# Altium project SysP17_Team10.PrjPcb
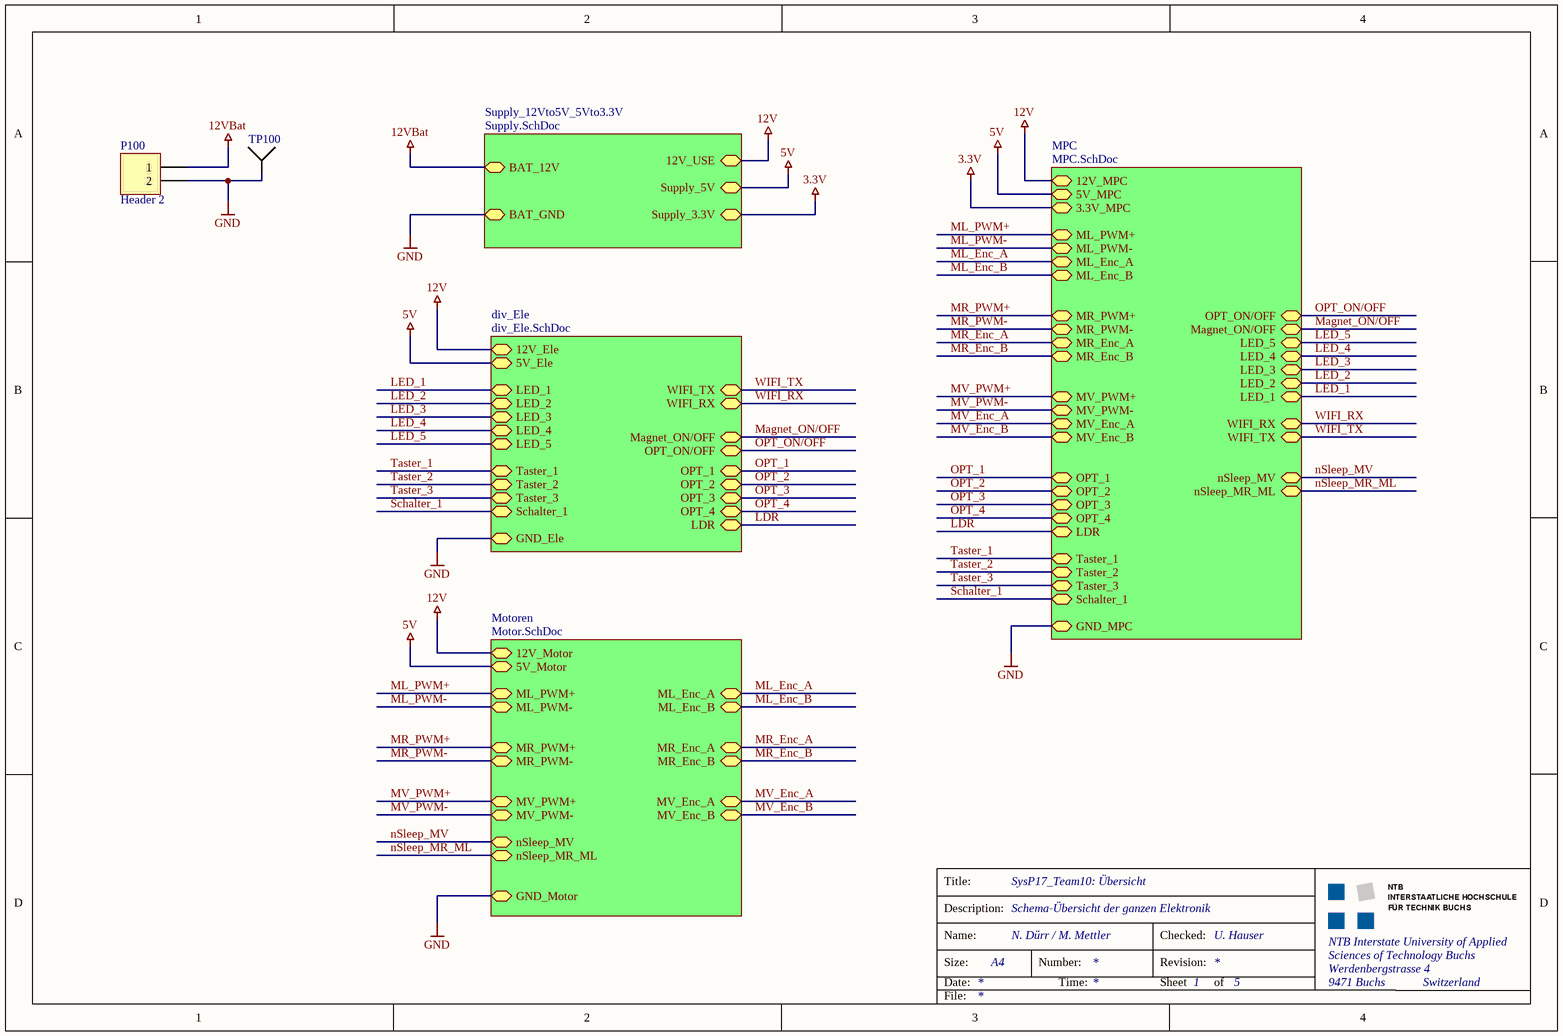
[diagram p0: SysP_Uebersicht.SchDoc]
4 sheets, 92 parts. Net scope: hierarchical (ports join the sheet entries above them; power ports are global).
Board file: Print.PcbDoc
Sheets:
  SysP_Uebersicht.SchDoc
    Supply_12Vto5V_5Vto3.3V = Supply.SchDoc
    div_Ele = div_Ele.SchDoc
    MPC = MPC.SchDoc

## Sheet SysP_Uebersicht.SchDoc: SysP17_Team10: Übersicht
size A4; CheckedBy: U. Hauser; Author: N. Dürr / M. Mettler; CompanyName: NTB; Organization: NTB Interstate University of Applied; Address1: Werdenbergstrasse 4; Address3: 9471 Buchs; Address4: Switzerland; SheetNumber: 1; SheetTotal: 5; Organization1: Sciences of Technology Buchs; Size: A4; ShortDescription: Schema-Übersicht der ganzen Elektronik

### Parts
P100  Header 2  [Connector_Bat_2]
TP100  Testpunkt 1mm  [GEN_TP-THT-1.1mm_1_H]  (value not drawn)

### Sub-sheets
div_Ele = div_Ele.SchDoc: LED_1, LED_2, LED_3, LED_4, LED_5, Taster_1, Taster_2, Taster_3, Schalter_1, WIFI_TX, WIFI_RX, Magnet_ON/OFF, OPT_ON/OFF, OPT_1, OPT_2, OPT_3, OPT_4, LDR, GND_Ele, 12V_Ele, 5V_Ele
Motoren = Motor.SchDoc (file not in this document): ML_PWM+, ML_PWM-, ML_Enc_A, ML_Enc_B, MR_PWM+, MR_PWM-, MR_Enc_A, MR_Enc_B, MV_PWM+, MV_PWM-, MV_Enc_A, MV_Enc_B, 12V_Motor, 5V_Motor, GND_Motor, nSleep_MV, nSleep_MR_ML
MPC = MPC.SchDoc: ML_PWM+, ML_PWM-, ML_Enc_A, ML_Enc_B, MR_PWM+, MR_PWM-, MR_Enc_A, MR_Enc_B, MV_PWM+, MV_PWM-, MV_Enc_A, MV_Enc_B, OPT_1, OPT_2, OPT_3, OPT_4, OPT_ON/OFF, Taster_1, Taster_2, Taster_3, Schalter_1, Magnet_ON/OFF, LED_5, LED_4, LED_3, LED_2, LED_1, WIFI_TX, WIFI_RX, LDR, 12V_MPC, 5V_MPC, 3.3V_MPC, GND_MPC, nSleep_MV, nSleep_MR_ML
Supply_12Vto5V_5Vto3.3V = Supply.SchDoc: BAT_12V, BAT_GND, Supply_5V, Supply_3.3V, 12V_USE

### Nets
3.3V: sheet Supply_12Vto5V_5Vto3.3V/Supply_3.3V, sheet MPC/3.3V_MPC
5V: sheet Supply_12Vto5V_5Vto3.3V/Supply_5V, sheet div_Ele/5V_Ele, sheet Motoren/5V_Motor, sheet MPC/5V_MPC
12V: sheet Supply_12Vto5V_5Vto3.3V/12V_USE, sheet div_Ele/12V_Ele, sheet Motoren/12V_Motor, sheet MPC/12V_MPC
12VBat: P100.1 ; sheet Supply_12Vto5V_5Vto3.3V/BAT_12V
GND: P100.2 TP100.1 ; sheet Supply_12Vto5V_5Vto3.3V/BAT_GND, sheet div_Ele/GND_Ele, sheet Motoren/GND_Motor, sheet MPC/GND_MPC
LDR: sheet div_Ele/LDR, sheet MPC/LDR
LED_1: sheet div_Ele/LED_1, sheet MPC/LED_1
LED_2: sheet div_Ele/LED_2, sheet MPC/LED_2
LED_3: sheet div_Ele/LED_3, sheet MPC/LED_3
LED_4: sheet div_Ele/LED_4, sheet MPC/LED_4
LED_5: sheet div_Ele/LED_5, sheet MPC/LED_5
Magnet_ON/OFF: sheet div_Ele/Magnet_ON/OFF, sheet MPC/Magnet_ON/OFF
ML_Enc_A: sheet Motoren/ML_Enc_A, sheet MPC/ML_Enc_A
ML_Enc_B: sheet Motoren/ML_Enc_B, sheet MPC/ML_Enc_B
ML_PWM+: sheet Motoren/ML_PWM+, sheet MPC/ML_PWM+
ML_PWM-: sheet Motoren/ML_PWM-, sheet MPC/ML_PWM-
MR_Enc_A: sheet Motoren/MR_Enc_A, sheet MPC/MR_Enc_A
MR_Enc_B: sheet Motoren/MR_Enc_B, sheet MPC/MR_Enc_B
MR_PWM+: sheet Motoren/MR_PWM+, sheet MPC/MR_PWM+
MR_PWM-: sheet Motoren/MR_PWM-, sheet MPC/MR_PWM-
MV_Enc_A: sheet Motoren/MV_Enc_A, sheet MPC/MV_Enc_A
MV_Enc_B: sheet Motoren/MV_Enc_B, sheet MPC/MV_Enc_B
MV_PWM+: sheet Motoren/MV_PWM+, sheet MPC/MV_PWM+
MV_PWM-: sheet Motoren/MV_PWM-, sheet MPC/MV_PWM-
nSleep_MR_ML: sheet Motoren/nSleep_MR_ML, sheet MPC/nSleep_MR_ML
nSleep_MV: sheet Motoren/nSleep_MV, sheet MPC/nSleep_MV
OPT_1: sheet div_Ele/OPT_1, sheet MPC/OPT_1
OPT_2: sheet div_Ele/OPT_2, sheet MPC/OPT_2
OPT_3: sheet div_Ele/OPT_3, sheet MPC/OPT_3
OPT_4: sheet div_Ele/OPT_4, sheet MPC/OPT_4
OPT_ON/OFF: sheet div_Ele/OPT_ON/OFF, sheet MPC/OPT_ON/OFF
Schalter_1: sheet div_Ele/Schalter_1, sheet MPC/Schalter_1  [project net Schalter1+]
Taster_1: sheet div_Ele/Taster_1, sheet MPC/Taster_1  [project net Taster1+]
Taster_2: sheet div_Ele/Taster_2, sheet MPC/Taster_2  [project net Taster2+]
Taster_3: sheet div_Ele/Taster_3, sheet MPC/Taster_3  [project net Taster3+]
WIFI_RX: sheet div_Ele/WIFI_RX, sheet MPC/WIFI_RX
WIFI_TX: sheet div_Ele/WIFI_TX, sheet MPC/WIFI_TX

### Notes on the sheet
- Title:
- Description:
- Size:
- Date:
- Name:
- Number:
- Time:
- Revision:
- Sheet
- Checked:
- of
- File:

### Library data of the parts
P100 = Header 2: Header, 2-Pin; LatestRevisionDate: 17-Jul-2002; LatestRevisionNote: Re-released for DXP Platform.; Publisher: Altium Limited
TP100 = Testpunkt 1mm: Manufacturer: Keystone Electronics; #Class: Connector; #ClassSub: Laborbuchse; Publisher: B.Sc. Ursella; Published: 2008-12-16; Supplier 1: Mouser; Supplier Part Number 1: 534-1035; Status: nLager; FootprintRef: GEN_TP-THT-1.1mm_1_H; RefFootprint: GEN_TP-THT-1.1mm_1_H; RefFileFOO: *; RefFileSCH: *; RefSchema: Testpunkt 1mm

## Sheet Supply.SchDoc: SysP_Team10: Spannungsregler
size A4; CheckedBy: U. Hauser; Author: N. Dürr / M. Mettler; CompanyName: NTB; Organization: NTB Interstate University of Applied; Address1: Werdenbergstrasse 4; Address3: 9471 Buchs; Address4: Switzerland; SheetNumber: 2; SheetTotal: 5; Organization1: Sciences of Technology Buchs; Size: A4; ShortDescription: Schema der Spannungsregelung-Schaltung
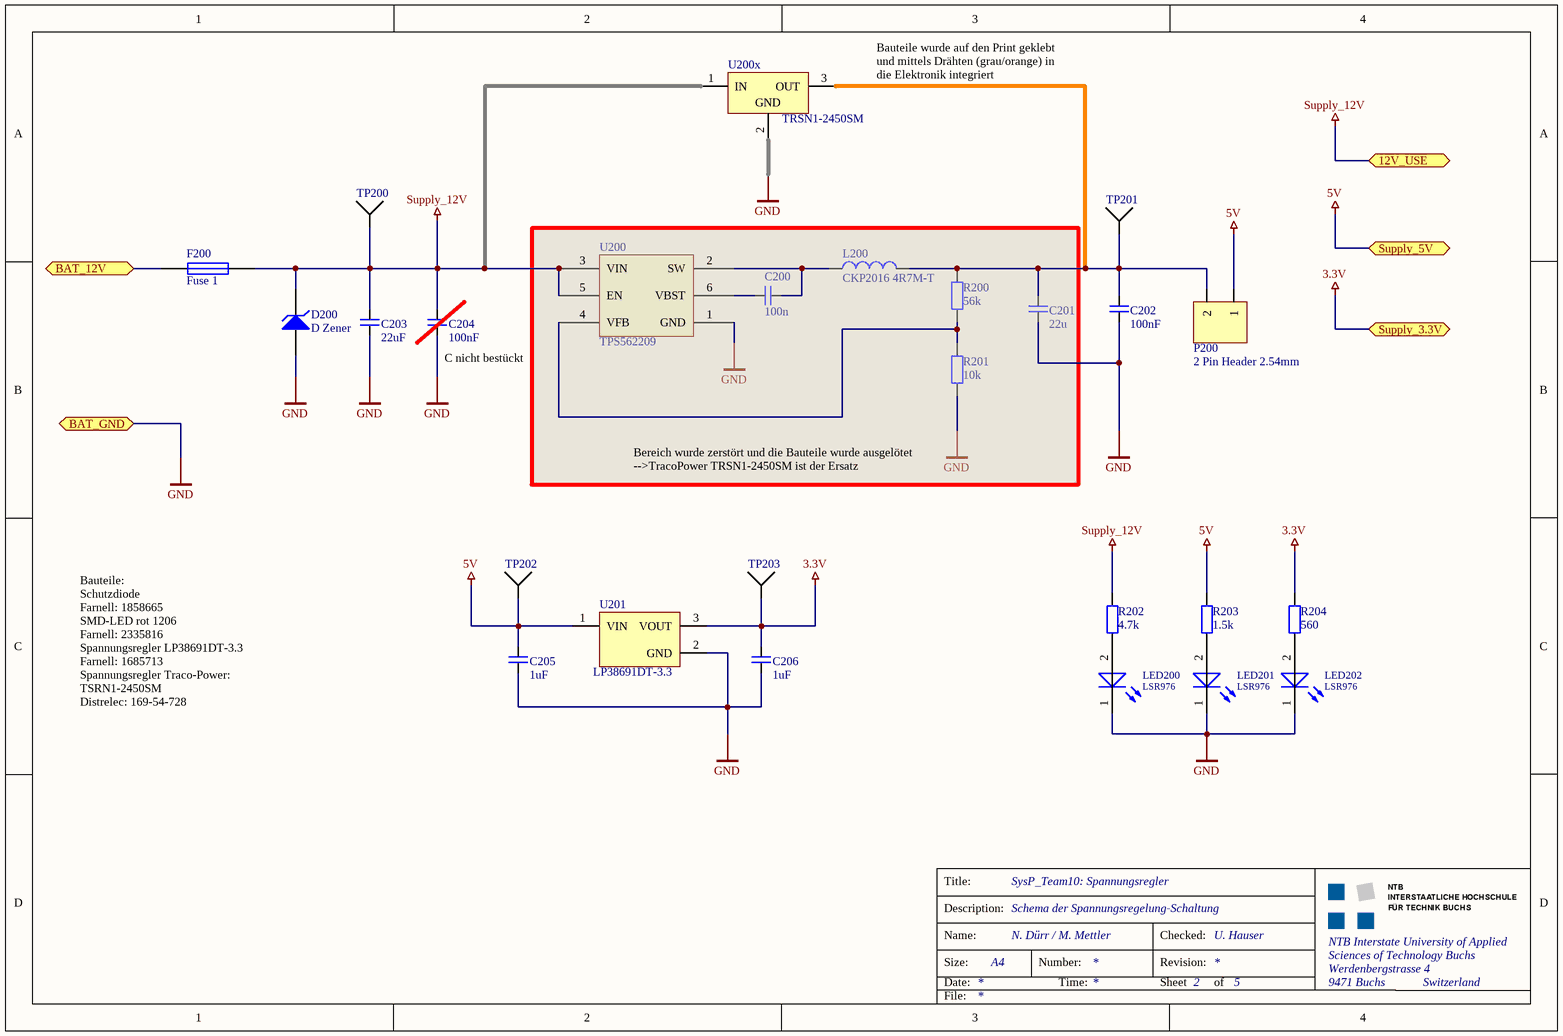
[diagram p1: Supply.SchDoc]

### Parts
C200  100n  [CAPC0805]
C201  22u  [C0805]
C202  100nF  [C0805]
C203  22uF  [CAPC0805]
C204  100nF  [CAPC0805]
C205  1uF  [CAPC0805]
C206  1uF  [CAPC0805]
D200  D Zener  [SMD_2Pin]
F200  Fuse 1  [Connector_2]
L200  CKP2016 4R7M-T  [IND0806]
LED200  LSR976  [CAPC1206]
LED201  LSR976  [CAPC1206]
LED202  LSR976  [CAPC1206]
P200  2 Pin Header 2.54mm  [2Pin Header 2.54mm]
R200  value 56k  [GEN_R0805_H]  (hidden comment: Generic)
R201  value 10k  [GEN_R0805_H]  (hidden comment: Generic)
R202  value 4.7k  [GEN_R0805_H]  (hidden comment: Generic)
R203  value 1.5k  [GEN_R0805_H]  (hidden comment: Generic)
R204  value 560  [GEN_R0805_H]  (hidden comment: Generic)
TP200  Testpunkt 1mm  [GEN_TP-THT-1.1mm_1_H]  (value not drawn)
TP201  Testpunkt 1mm  [GEN_TP-THT-1.1mm_1_H]  (value not drawn)
TP202  Testpunkt 1mm  [GEN_TP-THT-1.1mm_1_H]  (value not drawn)
TP203  Testpunkt 1mm  [GEN_TP-THT-1.1mm_1_H]  (value not drawn)
U200  TPS562209  [SOT23-6]
U200x  TRSN1-2450SM  [KC03]
U201  LP38691DT-3.3  [TO_252_3]

### Ports
12V_USE, BAT_12V, BAT_GND, Supply_3.3V, Supply_5V

### Nets
3.3V: C206.1 R204.2 TP203.1 U201.3(VOUT) ; port Supply_3.3V
5V: C205.1 P200.1 R203.2 TP202.1 U201.1(VIN) ; port Supply_5V
12VBat: F200.1 ; port BAT_12V
GND: C201.2 C202.2 C203.2 C204.2 C205.2 C206.2 D200.1(A) LED200.1(K) LED201.1(K) LED202.1(K) R201.1 U200.1(GND) U200x.2(GND) U201.2(GND) ; port BAT_GND
Supply_12V: C203.1 C204.1 D200.2(K) F200.2 R202.2 TP200.1 U200.3(VIN) U200.5(EN) U200x.1(IN) ; port 12V_USE  [project net 12V]
NetC200_1: C200.1 U200.6(VBST)
NetC200_2: C200.2 L200.1 U200.2(SW)
NetC201_1: C201.1 C202.1 L200.2 P200.2 R200.2 TP201.1 U200x.3(OUT)
NetLED200_2: LED200.2(A) R202.1
NetLED201_2: LED201.2(A) R203.1
NetLED202_2: LED202.2(A) R204.1
NetR200_1: R200.1 R201.2 U200.4(VFB)

### Notes on the sheet
- Bauteile wurde auf den Print geklebt
  und mittels Drähten (grau/orange) in die Elektronik integriert
- (near C204) C nicht bestückt
- Bereich wurde zerstört und die Bauteile wurde ausgelötet
  -->TracoPower TRSN1-2450SM ist der Ersatz
- Bauteile:
  Schutzdiode
  Farnell: 1858665
  SMD-LED rot 1206
  Farnell: 2335816
  Spannungsregler LP38691DT-3.3
  Farnell: 1685713
  Spannungsregler Traco-Power: TSRN1-2450SM
  Distrelec: 169-54-728
- Title:
- Description:
- Size:
- Date:
- Name:
- Number:
- Time:
- Revision:
- Sheet
- Checked:
- of
- File:

### Library data of the parts
C200 C203 = C Bipolar 0805: X7R MLCC 0805 (2012 Metric); Rated Voltage: 50V; Tolerance: 10%; Case-EIA: 0805; Case-Metric: 2012; Temperature Characteristics EIA: X7R; Temperature Range EIA: -55C/+125C
  C200: Value: 100n
  C203: Value: 22uF
C201 C202 = C Bipolar 1206: X7R MLCC 1206 (3016 Metric); Rated Voltage: 10V; Tolerance: 10%; Case-EIA: 1206; Case-Metric: 3216; Temperature Characteristics EIA: X7R; Temperature Range EIA: -55C/+125C
  C201: Value: 22u
  C202: Value: 100nF
C204-C206 = C Bipolar 0805: X7R MLCC 0805 (2012 Metric); Rated Voltage: 50V; Value: 100n; Tolerance: 10%; Case-EIA: 0805; Case-Metric: 2012; Temperature Characteristics EIA: X7R; Temperature Range EIA: -55C/+125C
D200 = D Zener: Zener Diode; Published: 8-Jun-2000; LatestRevisionDate: 17-Jul-2002; LatestRevisionNote: Re-released for DXP Platform.; PackageReference: DIODE-0.7; Publisher: Altium Limited; PackageDescription: Diode, Thru-Hole; 2 Leads; 0.7 in Pin Spacing
F200 = Fuse 1: Fuse; Published: 8-Jun-2000; LatestRevisionDate: 17-Jul-2002; LatestRevisionNote: Re-released for DXP Platform.; PackageReference: PIN-W2/E2.8; Publisher: Altium Limited; PackageDescription: Thru-Hole; 2 Leads
L200 = L: MULTILAYER CHIP POWER INDUCTORS; Manufactor: Taiyo Yuden; Current Rating: 900mA; DCR: 160mOhm; Inductance: 4u7; ComponentLink1Description: Datasheet Taiyo Yuden CK Series; ComponentLink1URL: V:\Inductor\Taiyo_Yuden_CK_Series.pdf
LED200-LED202 = OSR_LSR976_0805(1K2A): Hyper ChipLED, Red,; Manufacturer: OSRAM; #Class: DIODE; #ClassSub: LED; RefFootprint: GEN_LED0805_1K2A_2_H; ComponentLink1Description: Manufacturer Link; ComponentLink1URL: http://www.osram-os.com/osram_os/en/products/product-catalog/led-light-emitting-diodes/chipled/chipled-0805/ls-r976/index.jsp?search_result=%2fosram_os%2fen%2fsearch%2fadvanced_search.jsp%3faction%3ddosearch%26inp_searchterm_1%3dLS%2bR976%26website_name%3dosram_os_en; ComponentLink2Description: Datasheet; ComponentLink2URL: http://catalog.osram-os.com/catalogue/catalogue.do;jsessionid=8A0FA5146E77D3A917A5A5D383CD44B4?act=downloadFile&favOid=0200000600039319000100b6; ComponentLink3Description: Packaging Specification; ComponentLink3URL: http://catalog.osram-os.com/catalogue/catalogue.do;jsessionid=8A0FA5146E77D3A917A5A5D383CD44B4?act=downloadFile&favOid=0200000600039319000100b6; Distributor: Farnell; Manufacturer PartNr: LSR976; Distributor PartNr: 1226392; Published: 20121218; Publisher: Stefan Ursella, M.Eng; RefFileFOO: *; RefFileSCH: *; RefSchema: OSR_LSR976_0805(1K2A)
P200 = 2 Pin Connector
R200-R204 = GEN_R_2: generic resistor; Manufacturer: Tbd; #Class: PASSIVE; Published: 8-Jun-2000; Publisher: Altium Limited; #ClassSub: RESISTOR; ComponentLink1Description: Manufacturer Link; ComponentLink2Description: Datasheet; ComponentLink3Description: Packaging Specification; Distributor: tbd; RefFootprint: GEN_R0805_H; Manufacturer PartNr: tbd; Distributor PartNr: tbd; RefFileFOO: *; RefFileSCH: *; RefSchema: GEN_R_2
TP200-TP203 = Testpunkt 1mm: as TP100 on sheet SysP_Uebersicht; Publisher: B.Sc. Ursella; Published: 2008-12-16; Supplier 1: Mouser; Supplier Part Number 1: 534-1035; Status: nLager; FootprintRef: GEN_TP-THT-1.1mm_1_H; RefFootprint: GEN_TP-THT-1.1mm_1_H; RefFileFOO: *; RefFileSCH: *; RefSchema: Testpunkt 1mm
U200 = TPS562209: 3-A Synchronous Step-Down Voltage Regulator; Manufactor: Texas Instruments; Order Nr.: TPS562209DDCR; ComponentLink1Description: Datasheet TPS56x209; ComponentLink1URL: V:\Power_Management_ICs\PWM_Cont\TPS56x209.pdf
U200x = LM330KC: 3-Terminal Positive Regulator; Note: Pin 2 is electrically connected to tab; Published: 15-Apr-2002; DatasheetVersion: Apr-1988; PackageVersion: Sep-1995; PackageReference: KC03; Publisher: Altium Limited; PackageDescription: TO, Thru-Hole, Vertical, Heatsink Mounted; 3 In-Line Leads; Pitch 2.54 mm; ComponentLink1Description: Manufacturer Link; ComponentLink1URL: http://www.ti.com/
U201 = MCP1700T-2302E/MB: Low Quiescent Current LDO, 3-Pin SOT-89, Extended Temperature, Tape and Reel; Published: 29-Jan-2009; DatasheetVersion: revB, Feb-2007; PackageVersion: revBB, Aug-2009; PackageReference: SOT-89-MB3; Publisher: Altium Limited; PackageDescription: 3-Lead Plastic Small Outline Transistor Header (MB) [SOT-89]; Code_IPC: SOT89; ComponentLink1Description: Datasheet; ComponentLink1URL: http://ww1.microchip.com/downloads/en/DeviceDoc/21826b.pdf; ComponentLink2Description: Packaging Specification; ComponentLink2URL: http://www.microchip.com/stellent/groups/techpub_sg/documents/packagingspec/en012702.pdf; ComponentLink3Description: Microchip.com Home; ComponentLink3URL: http://www.microchip.com/

## Sheet div_Ele.SchDoc: SysP17_Team10: div. Elektronik
size A4; CheckedBy: U. Hauser; Author: N. Dürr / M. Mettler; CompanyName: NTB; Organization: NTB Interstate University of Applied; Address1: Werdenbergstrasse 4; Address3: 9471 Buchs; Address4: Switzerland; SheetNumber: 3; SheetTotal: 5; Organization1: Sciences of Technology Buchs; Size: A4; ShortDescription: Schema von einzelnen Schaltungen
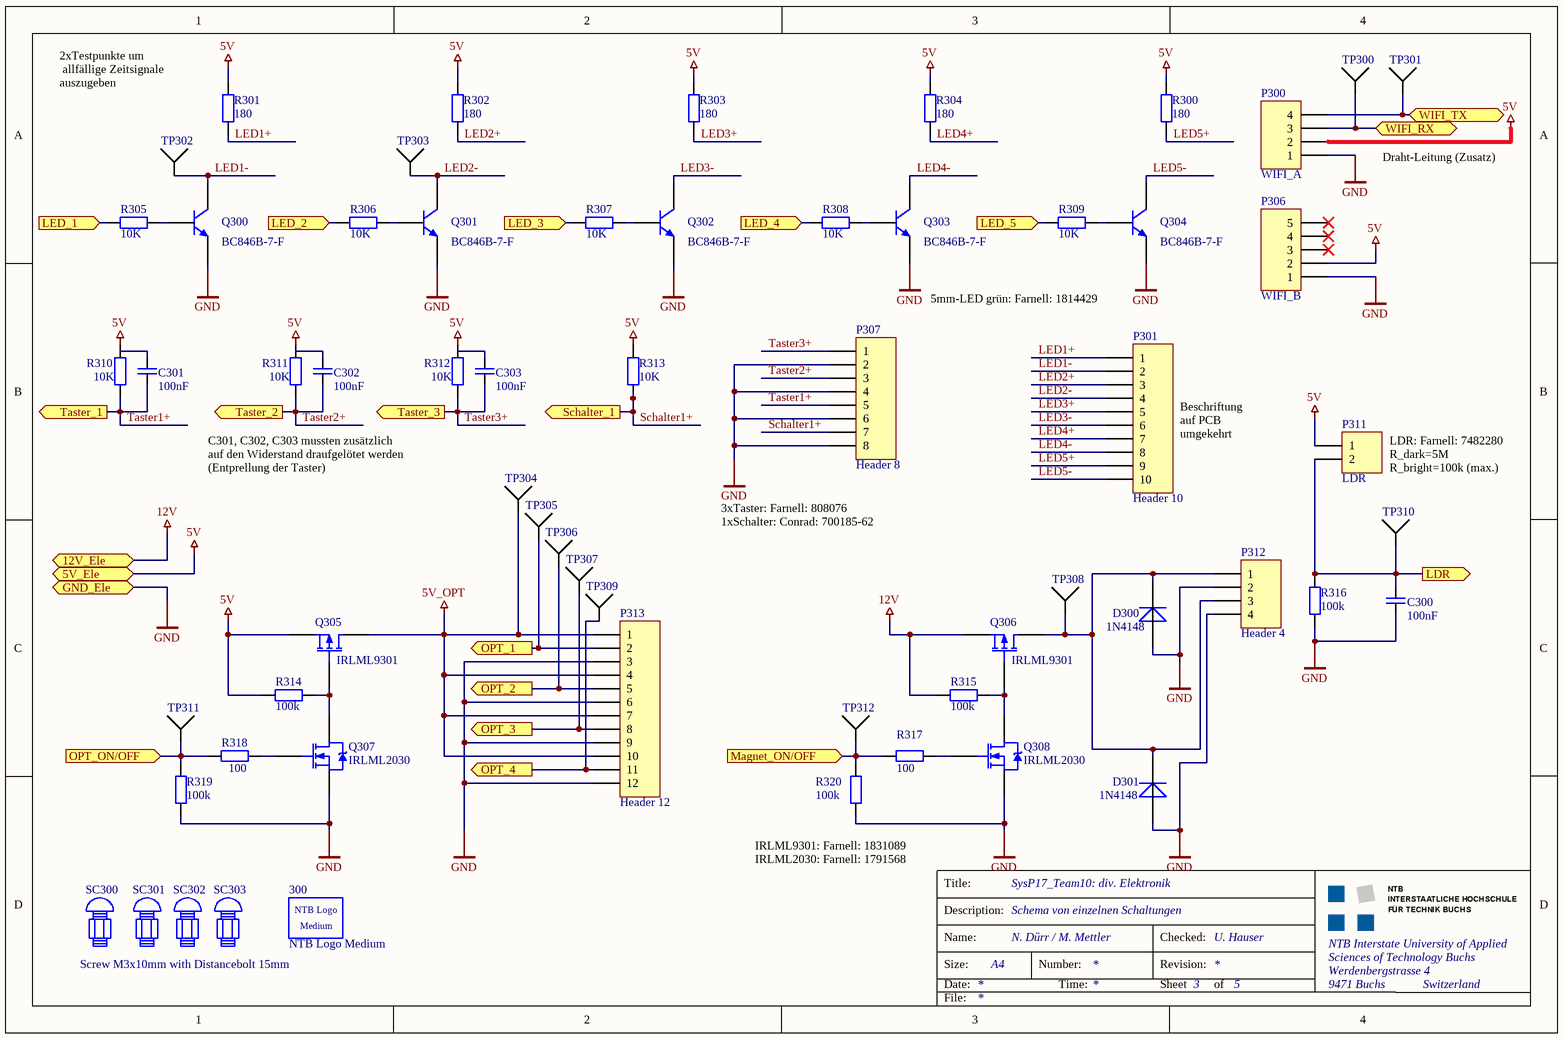
[diagram p2: div_Ele.SchDoc]

### Parts
300  NTB Logo Medium  [NTB Logo Medium]
C300  100nF  [CAPC0805]
C301  100nF  [CAPC0805]
C302  100nF  [CAPC0805]
C303  100nF  [CAPC0805]
D300  1N4148  [SMD_2Pin_Diode]
D301  1N4148  [SMD_2Pin_Diode]
P300  WIFI_A  [HDR1X4]
P301  Header 10  [HDR1X10]
P306  WIFI_B  [HDR1X5]
P307  Header 8  [HDR1X8]
P311  LDR  [2Pin Header 2.54mm]
P312  Header 4  [HDR1X4]
P313  Header 12  [HDR1X12]
Q300  BC846B-7-F  [DIODS_SOT23_1B2E3C_3_H]
Q301  BC846B-7-F  [DIODS_SOT23_1B2E3C_3_H]
Q302  BC846B-7-F  [DIODS_SOT23_1B2E3C_3_H]
Q303  BC846B-7-F  [DIODS_SOT23_1B2E3C_3_H]
Q304  BC846B-7-F  [DIODS_SOT23_1B2E3C_3_H]
Q305  IRLML9301  [SOT23_L]
Q306  IRLML9301  [SOT23_L]
Q307  IRLML2030  [SOT23_L]
Q308  IRLML2030  [SOT23_L]
R300  value 180  [GEN_R0805_H]  (hidden comment: Generic)
R301  value 180  [GEN_R0805_H]  (hidden comment: Generic)
R302  value 180  [GEN_R0805_H]  (hidden comment: Generic)
R303  value 180  [GEN_R0805_H]  (hidden comment: Generic)
R304  value 180  [GEN_R0805_H]  (hidden comment: Generic)
R305  value 10K  [GEN_R0805_H]  (hidden comment: Generic)
R306  value 10K  [GEN_R0805_H]  (hidden comment: Generic)
R307  value 10K  [GEN_R0805_H]  (hidden comment: Generic)
R308  value 10K  [GEN_R0805_H]  (hidden comment: Generic)
R309  value 10K  [GEN_R0805_H]  (hidden comment: Generic)
R310  value 10K  [GEN_R0805_H]  (hidden comment: Generic)
R311  value 10K  [GEN_R0805_H]  (hidden comment: Generic)
R312  value 10K  [GEN_R0805_H]  (hidden comment: Generic)
R313  value 10K  [GEN_R0805_H]  (hidden comment: Generic)
R314  value 100k  [GEN_R0805_H]  (hidden comment: Generic)
R315  value 100k  [GEN_R0805_H]  (hidden comment: Generic)
R316  value 100k  [GEN_R0805_H]  (hidden comment: Generic)
R317  value 100  [GEN_R0805_H]  (hidden comment: Generic)
R318  value 100  [GEN_R0805_H]  (hidden comment: Generic)
R319  value 100k  [GEN_R0805_H]  (hidden comment: Generic)
R320  value 100k  [GEN_R0805_H]  (hidden comment: Generic)
SC300  Screw M3x10mm with Distancebolt 15mm  [Screw_M3x10_Dist_15mm]  (value not drawn)
SC301  Screw M3x10mm with Distancebolt 15mm  [Screw_M3x10_Dist_15mm]  (value not drawn)
SC302  Screw M3x10mm with Distancebolt 15mm  [Screw_M3x10_Dist_15mm]
SC303  Screw M3x10mm with Distancebolt 15mm  [Screw_M3x10_Dist_15mm]  (value not drawn)
TP300  Testpunkt 1mm  [GEN_TP-THT-1.1mm_1_H]  (value not drawn)
TP301  Testpunkt 1mm  [GEN_TP-THT-1.1mm_1_H]  (value not drawn)
TP302  Testpunkt 1mm  [GEN_TP-THT-1.1mm_1_H]  (value not drawn)
TP303  Testpunkt 1mm  [GEN_TP-THT-1.1mm_1_H]  (value not drawn)
TP304  Testpunkt 1mm  [GEN_TP-THT-1.1mm_1_H]  (value not drawn)
TP305  Testpunkt 1mm  [GEN_TP-THT-1.1mm_1_H]  (value not drawn)
TP306  Testpunkt 1mm  [GEN_TP-THT-1.1mm_1_H]  (value not drawn)
TP307  Testpunkt 1mm  [GEN_TP-THT-1.1mm_1_H]  (value not drawn)
TP308  Testpunkt 1mm  [GEN_TP-THT-1.1mm_1_H]  (value not drawn)
TP309  Testpunkt 1mm  [GEN_TP-THT-1.1mm_1_H]  (value not drawn)
TP310  Testpunkt 1mm  [GEN_TP-THT-1.1mm_1_H]  (value not drawn)
TP311  Testpunkt 1mm  [GEN_TP-THT-1.1mm_1_H]  (value not drawn)
TP312  Testpunkt 1mm  [GEN_TP-THT-1.1mm_1_H]  (value not drawn)

### Ports
5V_Ele, 12V_Ele, GND_Ele, LDR (out), LED_1 (in), LED_2 (in), LED_3 (in), LED_4 (in), LED_5 (in), Magnet_ON/OFF (in), OPT_1 (out), OPT_2 (out), OPT_3 (out), OPT_4 (out), OPT_ON/OFF (in), Schalter_1 (out), Taster_1 (out), Taster_2 (out), Taster_3 (out), WIFI_RX (bidir), WIFI_TX (bidir)

### Nets
5V: P300.2 P306.2 P311.1 Q305.2(S) R300.1 R301.1 R302.1 R303.1 R304.1 R310.1 R311.1 R312.1 R313.1 R314.2 ; port 5V_Ele
5V_OPT: P313.1 P313.4 P313.7 P313.10 Q305.1(D) TP304.1
12V: Q306.2(S) R315.2 ; port 12V_Ele
GND: C300.2 D300.2(A) D301.2(A) P300.1 P306.1 P307.2 P307.4 P307.6 P307.8 P312.2 P312.4 P313.3 P313.6 P313.9 P313.12 Q300.2(E) Q301.2(E) Q302.2(E) Q303.2(E) Q304.2(E) Q307.2(S) Q308.2(S) R316.2 R319.1 R320.1 ; port GND_Ele
LDR: C300.1 P311.2 R316.1 TP310.1 ; port LDR
LED1+: P301.1 R301.2
LED1-: P301.2 Q300.3(C) TP302.1
LED2+: P301.3 R302.2
LED2-: P301.4 Q301.3(C) TP303.1
LED3+: P301.5 R303.2
LED3-: P301.6 Q302.3(C)
LED4+: P301.7 R304.2
LED4-: P301.8 Q303.3(C)
LED5+: P301.9 R300.2
LED5-: P301.10 Q304.3(C)
LED_1: R305.1 ; port LED_1
LED_2: R306.1 ; port LED_2
LED_3: R307.1 ; port LED_3
LED_4: R308.1 ; port LED_4
LED_5: R309.1 ; port LED_5
Magnet_ON/OFF: R317.2 R320.2 TP312.1 ; port Magnet_ON/OFF
OPT_1: P313.2 TP305.1 ; port OPT_1
OPT_2: P313.5 TP306.1 ; port OPT_2
OPT_3: P313.8 TP307.1 ; port OPT_3
OPT_4: P313.11 TP309.1 ; port OPT_4
OPT_ON/OFF: R318.2 R319.2 TP311.1 ; port OPT_ON/OFF
Schalter1+: P307.7 R313.2 ; port Schalter_1
Taster1+: C301.2 P307.5 R310.2 ; port Taster_1
Taster2+: C302.2 P307.3 R311.2 ; port Taster_2
Taster3+: C303.2 P307.1 R312.2 ; port Taster_3
WIFI_RX: P300.3 TP300.1 ; port WIFI_RX
WIFI_TX: P300.4 TP301.1 ; port WIFI_TX
NetD300_1: D300.1(K) D301.1(K) P312.1 P312.3 Q306.1(D) TP308.1
NetQ300_1: Q300.1(B) R305.2
NetQ301_1: Q301.1(B) R306.2
NetQ302_1: Q302.1(B) R307.2
NetQ303_1: Q303.1(B) R308.2
NetQ304_1: Q304.1(B) R309.2
NetQ305_3: Q305.3(G) Q307.1(D) R314.1
NetQ306_3: Q306.3(G) Q308.1(D) R315.1
NetQ307_3: Q307.3(G) R318.1
NetQ308_3: Q308.3(G) R317.1

Not connected (* = marked no-connect by the designer): C301 1; C302 1; C303 1; P306 3* 4* 5*

### Notes on the sheet
- 2xTestpunkte um
  allfällige Zeitsignale
  auszugeben
- Draht-Leitung (Zusatz)
- 5mm-LED grün: Farnell: 1814429
- (near P301) Beschriftung auf PCB umgekehrt
- C301, C302, C303 mussten zusätzlich
  auf den Widerstand draufgelötet werden
  (Entprellung der Taster)
- LDR: Farnell: 7482280
  R_dark=5M
  R_bright=100k (max.)
- 3xTaster: Farnell: 808076
  1xSchalter: Conrad: 700185-62
- (near R320) IRLML9301: Farnell: 1831089
  IRLML2030: Farnell: 1791568
- Title:
- Description:
- Size:
- Date:
- Name:
- Number:
- Time:
- Revision:
- Sheet
- Checked:
- of
- File:
- (in symbol NTB Logo Medium) NTB Logo; Medium

### Library data of the parts
C300-C303 = C Bipolar 0805: as C204 on sheet Supply; Temperature Characteristics EIA: X7R; Temperature Range EIA: -55C/+125C
D300 D301 = 1N4148: High Conductance Fast Diode; #Manufacturer: Generic Components; #Publisher: Dr. A. Heinzelmann; #Class: Discrete; #ClassSub: Diode - Switching; #Published: 2006-10-31; ComponentLink1Description: Datasheet; ComponentLink1URL: https://www.distrelec.com/distrelec/datasheets.nsf/WebAttachments/13CA773B80E18E83C125722E0045A8DA/$File/Diotec_Silizium-Dioden_bedrahtet_1N_4148_-_1N_4448_-_1N_4150..._Datasheet_DE_EN.pdf; ComponentLink2Description: Distributor; ComponentLink2URL: https://www.distrelec.ch/ishopWebFront/catalog/product.do/para/node/is/acaaaaaaaaaa/and/highlightNode/is/603016/and/id/is/01/and/series/is/1.html; Value: 1N4148
P300 P312 = Header 4: Header, 4-Pin; LatestRevisionDate: 17-Jul-2002; LatestRevisionNote: Re-released for DXP Platform.; Publisher: Altium Limited
P301 = Header 10: Header, 10-Pin; LatestRevisionDate: 17-Jul-2002; LatestRevisionNote: Re-released for DXP Platform.; Publisher: Altium Limited
P306 = Header 5: Header, 5-Pin; LatestRevisionDate: 17-Jul-2002; LatestRevisionNote: Re-released for DXP Platform.; Publisher: Altium Limited
P307 = Header 8: Header, 8-Pin; LatestRevisionDate: 17-Jul-2002; LatestRevisionNote: Re-released for DXP Platform.; Publisher: Altium Limited
P311 = Header 2: Header, 2-Pin; LatestRevisionDate: 17-Jul-2002; LatestRevisionNote: Re-released for DXP Platform.; Publisher: Altium Limited
P313 = Header 12: Header, 12-Pin; LatestRevisionDate: 17-Jul-2002; LatestRevisionNote: Re-released for DXP Platform.; Publisher: Altium Limited
Q300-Q304 = DIODS_BC846B-7-F_SOT23: NPN General-purpose Transistor; Manufacturer: DIODES INC; #Class: SEMICONDUCTOR-TRANSISTOR; #ClassSub: BJT-NPN; Published: 17-Sep-2003; Publisher: Altium Limited; ComponentLink1Description: Manufacturer Link; ComponentLink1URL: http://www.diodes.com/products/catalog/detail.php?item-id=6689&popup=datasheet; ComponentLink2Description: Datasheet; ComponentLink2URL: http://www.diodes.com/datasheets/ds11108.pdf; ComponentLink3Description: Packaging Specification; ComponentLink3URL: http://www.diodes.com/datasheets/ap02001.pdf; Distributor: Farnell; RefFootprint: DIODS_SOT23_1B2E3C_3_H; Manufacturer PartNr: BC846B-7-F; Distributor PartNr: 1773617; Status: nLager; RefFileFOO: *; RefFileSCH: *; RefSchema: DIODS_BC846B-7-F_SOT23
Q305 Q306 = MOSFET-P: P-Channel MOSFET; Published: 8-Jun-2000; LatestRevisionDate: 17-Jul-2002; LatestRevisionNote: Re-released for DXP Platform.; PackageVersion: 1995/1996; PackageReference: E3; Publisher: Altium Limited; PackageDescription: TO, Flat Index; 3 In-Line, Axial Leads; Body Dia. 4.6mm; Lead Dia. 0.5 mm (max)
Q307 Q308 = NMOS-2: N-Channel Power MOSFET; Note: Pin 2 is electrically connected to pin 4.; Published: 8-Jun-2000; LatestRevisionDate: 17-Jul-2002; LatestRevisionNote: Re-released for DXP Platform.; DatasheetVersion: PD-9.814; PackageVersion: Feb-1997; PackageReference: TO-220AB; Publisher: Altium Limited; PackageDescription: TO, Thru-Hole, Vertical, Heatsink Mounted; 3 In-Line Leads; Pitch 2.54 mm; ComponentLink1Description: Manufacturer Link; ComponentLink1URL: http://www.irf.com/
R300-R320 = GEN_R_2: as R200 on sheet Supply; Published: 8-Jun-2000; Publisher: Altium Limited; #ClassSub: RESISTOR; ComponentLink1Description: Manufacturer Link; ComponentLink2Description: Datasheet; ComponentLink3Description: Packaging Specification; Distributor: tbd; RefFootprint: GEN_R0805_H; Manufacturer PartNr: tbd; Distributor PartNr: tbd; RefFileFOO: *; RefFileSCH: *; RefSchema: GEN_R_2
SC300-SC303 = Screw M3 10mm with Distancebolt 15mm
TP300-TP312 = Testpunkt 1mm: as TP100 on sheet SysP_Uebersicht; Publisher: B.Sc. Ursella; Published: 2008-12-16; Supplier 1: Mouser; Supplier Part Number 1: 534-1035; Status: nLager; FootprintRef: GEN_TP-THT-1.1mm_1_H; RefFootprint: GEN_TP-THT-1.1mm_1_H; RefFileFOO: *; RefFileSCH: *; RefSchema: Testpunkt 1mm

## Sheet MPC.SchDoc: SysP17_Team10: PIC
size A4; CheckedBy: U. Hauser; Author: N. Dürr / M. Mettler; CompanyName: NTB; Organization: NTB Interstate University of Applied; Address1: Werdenbergstrasse 4; Address3: 9471 Buchs; Address4: Switzerland; SheetNumber: 4; SheetTotal: 5; Organization1: Sciences of Technology Buchs; Size: A4; ShortDescription: Schema des PIC-Anschlusses
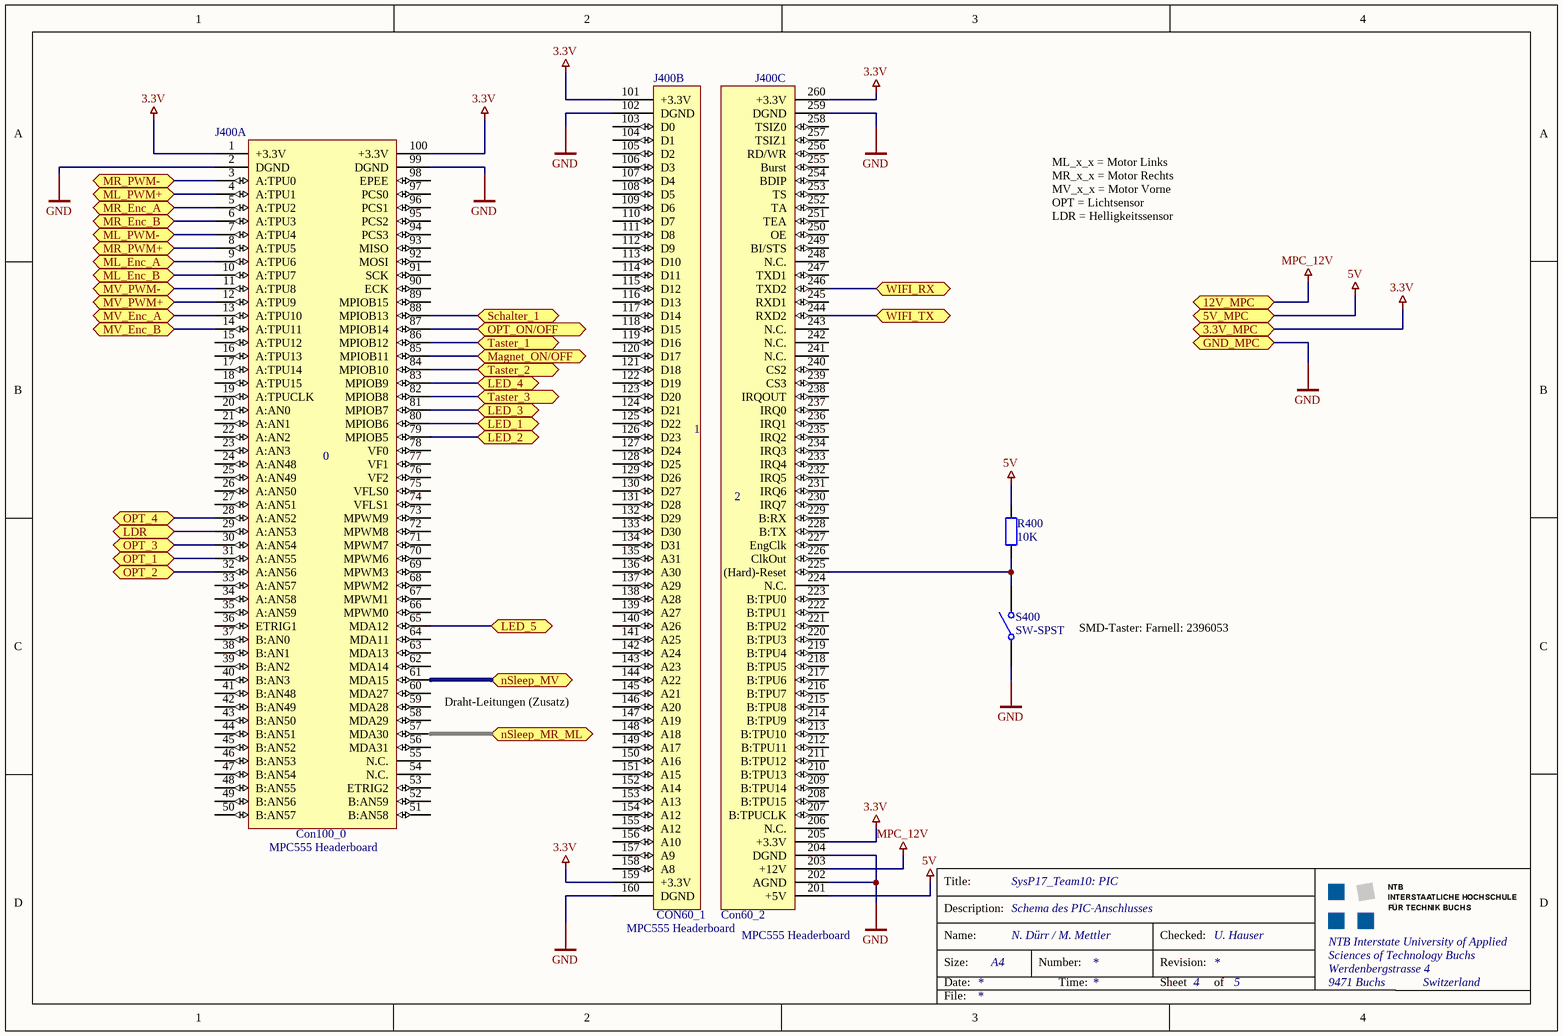
[diagram p3: MPC.SchDoc]

### Parts
J400  MPC555 Headerboard  [MPC555 Headerboard THT]  (parts A,B,C of 3)
R400  value 10K  [GEN_R0805_H]  (hidden comment: Generic)
S400  SW-SPST  [Taster]

### Ports
3.3V_MPC, 5V_MPC, 12V_MPC, GND_MPC, LDR (bidir), LED_1 (bidir), LED_2 (bidir), LED_3 (bidir), LED_4 (bidir), LED_5 (bidir), Magnet_ON/OFF (bidir), ML_Enc_A (bidir), ML_Enc_B (bidir), ML_PWM+ (bidir), ML_PWM- (bidir), MR_Enc_A (bidir), MR_Enc_B (bidir), MR_PWM+ (bidir), MR_PWM- (bidir), MV_Enc_A (bidir), MV_Enc_B (bidir), MV_PWM+ (bidir), MV_PWM- (bidir), nSleep_MR_ML (bidir), nSleep_MV (bidir), OPT_1 (bidir), OPT_2 (bidir), OPT_3 (bidir), OPT_4 (bidir), OPT_ON/OFF (bidir), Schalter_1 (bidir), Taster_1 (bidir), Taster_2 (bidir), Taster_3 (bidir), WIFI_RX (bidir), WIFI_TX (bidir)

### Nets
3.3V: J400.1(+3.3V) J400.100(+3.3V) J400.101(+3.3V) J400.159(+3.3V) J400.205(+3.3V) J400.260(+3.3V) ; port 3.3V_MPC
5V: J400.201(+5V) R400.2 ; port 5V_MPC
GND: J400.2(DGND) J400.99(DGND) J400.102(DGND) J400.160(DGND) J400.202(AGND) J400.204(DGND) J400.259(DGND) S400.1(COMMON) ; port GND_MPC
MPC_12V: J400.203(+12V) ; port 12V_MPC  [project net 12V]
LDR: J400.29(A:AN53) ; port LDR
LED_1: J400.80(MPIOB6) ; port LED_1
LED_2: J400.79(MPIOB5) ; port LED_2
LED_3: J400.81(MPIOB7) ; port LED_3
LED_4: J400.83(MPIOB9) ; port LED_4
LED_5: J400.65(MDA12) ; port LED_5
Magnet_ON/OFF: J400.85(MPIOB11) ; port Magnet_ON/OFF
ML_Enc_A: J400.9(A:TPU6) ; port ML_Enc_A
ML_Enc_B: J400.10(A:TPU7) ; port ML_Enc_B
ML_PWM+: J400.4(A:TPU1) ; port ML_PWM+
ML_PWM-: J400.7(A:TPU4) ; port ML_PWM-
MR_Enc_A: J400.5(A:TPU2) ; port MR_Enc_A
MR_Enc_B: J400.6(A:TPU3) ; port MR_Enc_B
MR_PWM+: J400.8(A:TPU5) ; port MR_PWM+
MR_PWM-: J400.3(A:TPU0) ; port MR_PWM-
MV_Enc_A: J400.13(A:TPU10) ; port MV_Enc_A
MV_Enc_B: J400.14(A:TPU11) ; port MV_Enc_B
MV_PWM+: J400.12(A:TPU9) ; port MV_PWM+
MV_PWM-: J400.11(A:TPU8) ; port MV_PWM-
nSleep_MR_ML: J400.57(MDA30) ; port nSleep_MR_ML
nSleep_MV: J400.61(MDA15) ; port nSleep_MV
OPT_1: J400.31(A:AN55) ; port OPT_1
OPT_2: J400.32(A:AN56) ; port OPT_2
OPT_3: J400.30(A:AN54) ; port OPT_3
OPT_4: J400.28(A:AN52) ; port OPT_4
OPT_ON/OFF: J400.87(MPIOB14) ; port OPT_ON/OFF
Schalter1+: J400.88(MPIOB13) ; port Schalter_1
Taster1+: J400.86(MPIOB12) ; port Taster_1
Taster2+: J400.84(MPIOB10) ; port Taster_2
Taster3+: J400.82(MPIOB8) ; port Taster_3
WIFI_RX: J400.246(TXD2) ; port WIFI_RX
WIFI_TX: J400.244(RXD2) ; port WIFI_TX
NetJ400_225: J400.225((Hard)-Reset) R400.1 S400.0(NO)

Not connected (* = marked no-connect by the designer): J400 15(A:TPU12) 16(A:TPU13) 17(A:TPU14) 18(A:TPU15) 19(A:TPUCLK) 20(A:AN0) 21(A:AN1) 22(A:AN2) 23(A:AN3) 24(A:AN48) 25(A:AN49) 26(A:AN50) 27(A:AN51) 33(A:AN57) 34(A:AN58) 35(A:AN59) 36(ETRIG1) 37(B:AN0) 38(B:AN1) 39(B:AN2) 40(B:AN3) 41(B:AN48) 42(B:AN49) 43(B:AN50) 44(B:AN51) 45(B:AN52) 46(B:AN53) 47(B:AN54) 48(B:AN55) 49(B:AN56) 50(B:AN57) 51(B:AN58) 52(B:AN59) 53(ETRIG2) 54(N.C.) 55(N.C.) 56(MDA31) 58(MDA29) 59(MDA28) 60(MDA27) 62(MDA14) 63(MDA13) 64(MDA11) 66(MPWM0) 67(MPWM1) 68(MPWM2) 69(MPWM3) 70(MPWM6) 71(MPWM7) 72(MPWM8) 73(MPWM9) 74(VFLS1) 75(VFLS0) 76(VF2) 77(VF1) 78(VF0) 89(MPIOB15) 90(ECK) 91(SCK) 92(MOSI) 93(MISO) 94(PCS3) 95(PCS2) 96(PCS1) 97(PCS0) 98(EPEE) 103(D0) 104(D1) 105(D2) 106(D3) 107(D4) 108(D5) 109(D6) 110(D7) 111(D8) 112(D9) 113(D10) 114(D11) 115(D12) 116(D13) 117(D14) 118(D15) 119(D16) 120(D17) 121(D18) 122(D19) 123(D20) 124(D21) 125(D22) 126(D23) 127(D24) 128(D25) 129(D26) 130(D27) 131(D28) 132(D29) 133(D30) 134(D31) 135(A31) 136(A30) 137(A29) 138(A28) 139(A27) 140(A26) 141(A25) 142(A24) 143(A23) 144(A22) 145(A21) 146(A20) 147(A19) 148(A18) 149(A17) 150(A16) 151(A15) 152(A14) 153(A13) 154(A12) 155(A12) 156(A10) 157(A9) 158(A8) 206(N.C.) 207(B:TPUCLK) 208(B:TPU15) 209(B:TPU14) 210(B:TPU13) 211(B:TPU12) 212(B:TPU11) 213(B:TPU10) 214(B:TPU9) 215(B:TPU8) 216(B:TPU7) 217(B:TPU6) 218(B:TPU5) 219(B:TPU4) 220(B:TPU3) 221(B:TPU2) 222(B:TPU1) 223(B:TPU0) 224(N.C.) 226(ClkOut) 227(EngClk) 228(B:TX) 229(B:RX) 230(IRQ7) 231(IRQ6) 232(IRQ5) 233(IRQ4) 234(IRQ3) 235(IRQ2) 236(IRQ1) 237(IRQ0) 238(IRQOUT) 239(CS3) 240(CS2) 241(N.C.) 242(N.C.) 243(N.C.) 245(RXD1) 247(TXD1) 248(N.C.) 249(BI/STS) 250(OE) 251(TEA) 252(TA) 253(TS) 254(BDIP) 255(Burst) 256(RD/WR) 257(TSIZ1) 258(TSIZ0)

### Notes on the sheet
- ML_x_x = Motor Links
  MR_x_x = Motor Rechts
  MV_x_x = Motor Vorne
  OPT = Lichtsensor
  LDR = Helligkeitssensor
- SMD-Taster: Farnell: 2396053
- (near J400) Draht-Leitungen (Zusatz)
- Title:
- Description:
- Size:
- Date:
- Name:
- Number:
- Time:
- Revision:
- Sheet
- Checked:
- of
- File:
- (in symbol MPC555 Headerboard, part A) 0; Con100_0
- (in symbol MPC555 Headerboard, part B) CON60_1
- (in symbol MPC555 Headerboard, part C) Con60_2

### Library data of the parts
J400 = MPC555 Headerboard: NTB MPC555 Headerboard
R400 = GEN_R_2: as R200 on sheet Supply; Published: 8-Jun-2000; Publisher: Altium Limited; #ClassSub: RESISTOR; ComponentLink1Description: Manufacturer Link; ComponentLink2Description: Datasheet; ComponentLink3Description: Packaging Specification; Distributor: tbd; RefFootprint: GEN_R0805_H; Manufacturer PartNr: tbd; Distributor PartNr: tbd; RefFileFOO: *; RefFileSCH: *; RefSchema: GEN_R_2
S400 = SW-SPST: Single-Pole, Single-Throw Switch; Published: 24-Mar-1999; LatestRevisionDate: 17-Jul-2002; LatestRevisionNote: Re-released for DXP Platform.; PackageReference: SPST-2; Publisher: Altium Limited; PackageDescription: Switch; 2 Leads

## Nets that join several sheets
3.3V: Supply (C206.1 R204.2 TP203.1 U201.3), MPC (6 pins)
5V: Supply (5 pins), div_Ele (14 pins), MPC (J400.201 R400.2)
12V: Supply (9 pins), div_Ele (Q306.2 R315.2), MPC (J400.203)
12VBat: SysP_Uebersicht (P100.1), Supply (F200.1)
GND: SysP_Uebersicht (P100.2 TP100.1), Supply (14 pins), div_Ele (25 pins), MPC (8 pins)
LDR: div_Ele (C300.1 P311.2 R316.1 TP310.1), MPC (J400.29)
LED_1: div_Ele (R305.1), MPC (J400.80)
LED_2: div_Ele (R306.1), MPC (J400.79)
LED_3: div_Ele (R307.1), MPC (J400.81)
LED_4: div_Ele (R308.1), MPC (J400.83)
LED_5: div_Ele (R309.1), MPC (J400.65)
Magnet_ON/OFF: div_Ele (R317.2 R320.2 TP312.1), MPC (J400.85)
OPT_1: div_Ele (P313.2 TP305.1), MPC (J400.31)
OPT_2: div_Ele (P313.5 TP306.1), MPC (J400.32)
OPT_3: div_Ele (P313.8 TP307.1), MPC (J400.30)
OPT_4: div_Ele (P313.11 TP309.1), MPC (J400.28)
OPT_ON/OFF: div_Ele (R318.2 R319.2 TP311.1), MPC (J400.87)
Schalter1+: div_Ele (P307.7 R313.2), MPC (J400.88)
Taster1+: div_Ele (C301.2 P307.5 R310.2), MPC (J400.86)
Taster2+: div_Ele (C302.2 P307.3 R311.2), MPC (J400.84)
Taster3+: div_Ele (C303.2 P307.1 R312.2), MPC (J400.82)
WIFI_RX: div_Ele (P300.3 TP300.1), MPC (J400.246)
WIFI_TX: div_Ele (P300.4 TP301.1), MPC (J400.244)